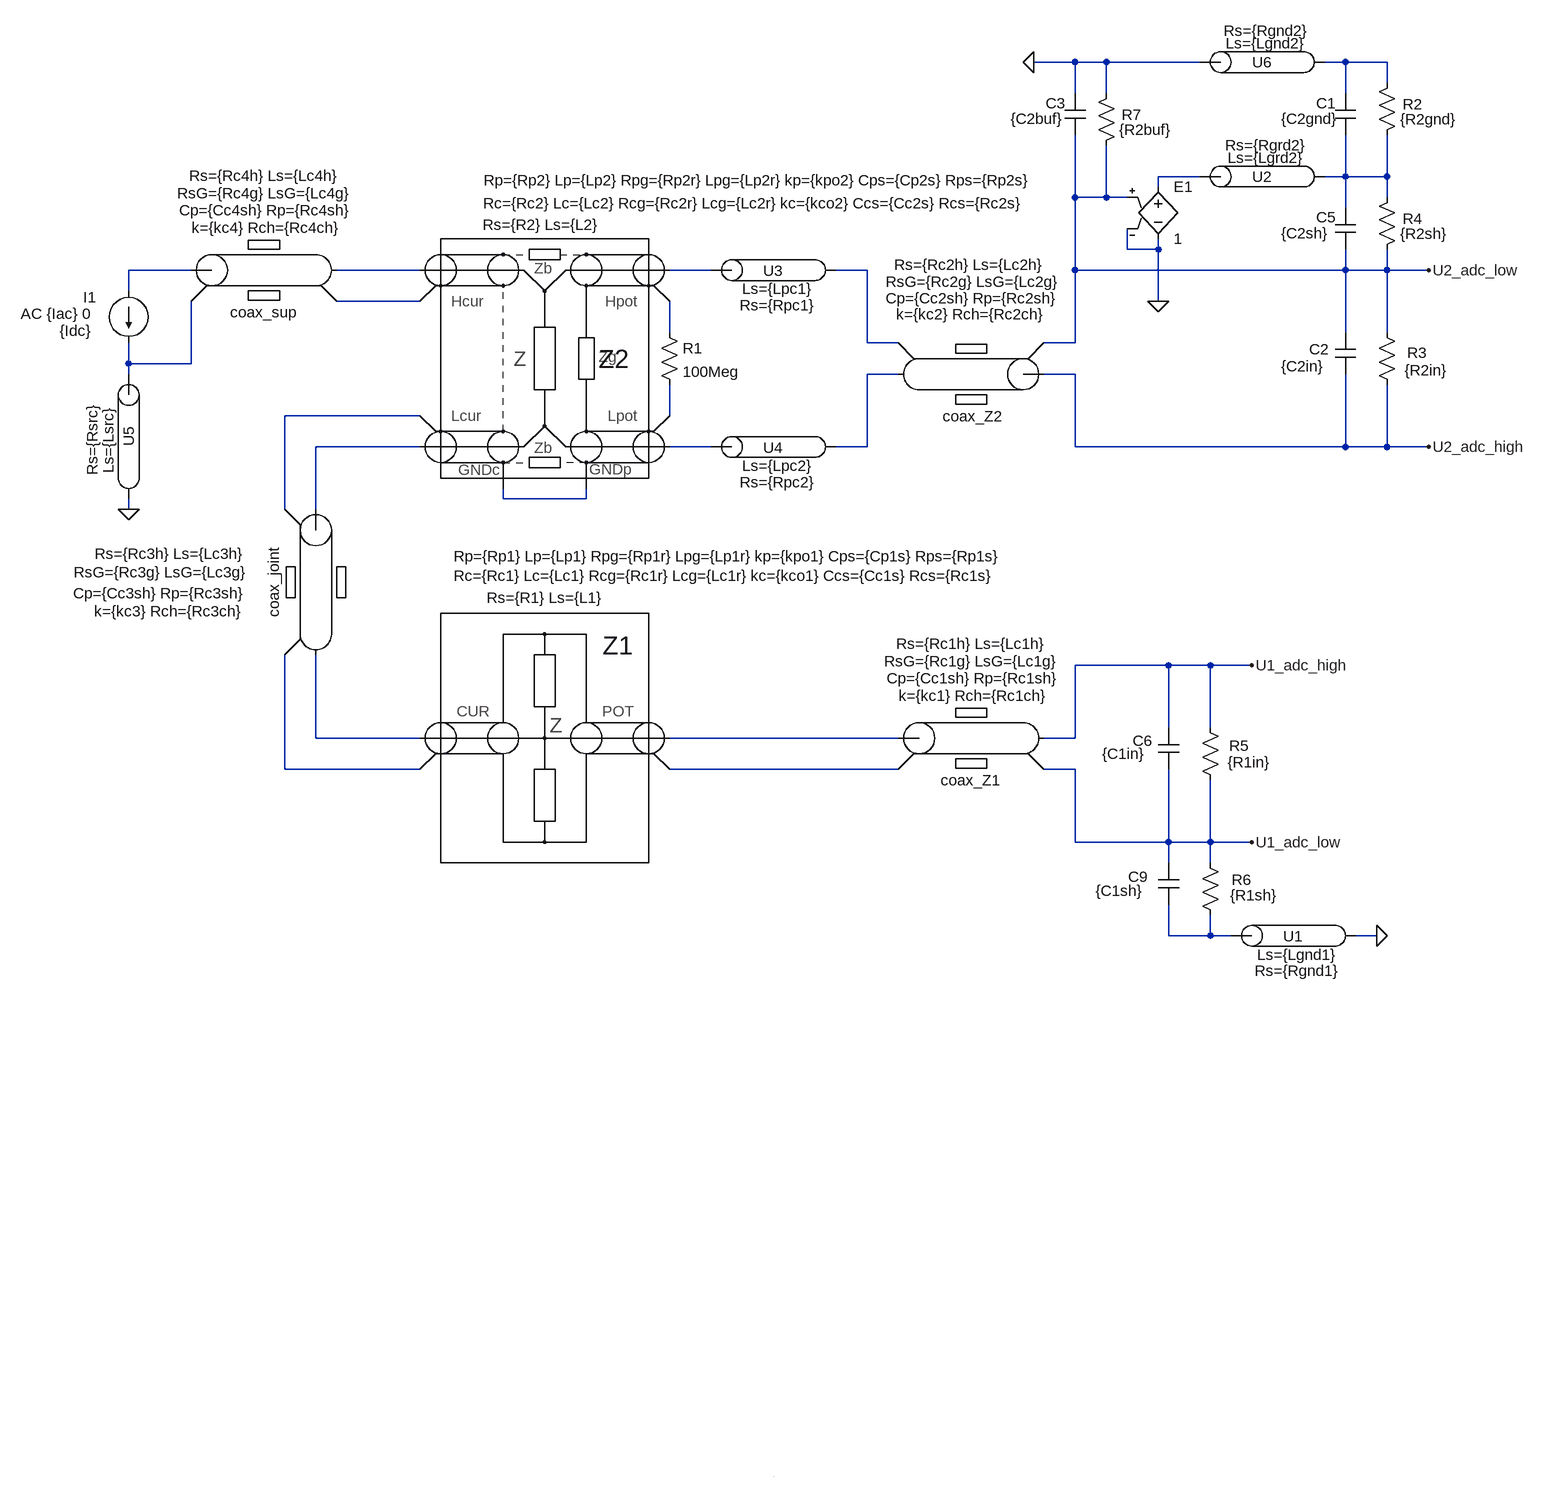
[diagram p0: schematic LiB_brg.asc]
LiB_brg.asc, the LTspice schematic file:
Version 4
SHEET 1 4400 2632
WIRE 464 -2176 400 -2176
WIRE 512 -2176 464 -2176
WIRE 656 -2176 512 -2176
WIRE 880 -2176 848 -2176
WIRE 944 -2176 880 -2176
WIRE 944 -2144 944 -2176
WIRE 464 -2128 464 -2176
WIRE 512 -2128 512 -2176
WIRE 880 -2128 880 -2176
WIRE 656 -2000 592 -2000
WIRE 880 -2000 880 -2064
WIRE 880 -2000 848 -2000
WIRE 944 -2000 944 -2064
WIRE 944 -2000 880 -2000
WIRE 592 -1984 592 -2000
WIRE 464 -1968 464 -2064
WIRE 512 -1968 512 -2048
WIRE 512 -1968 464 -1968
WIRE 544 -1968 512 -1968
WIRE 944 -1968 944 -2000
WIRE 880 -1952 880 -2000
WIRE 544 -1888 544 -1920
WIRE 592 -1888 592 -1904
WIRE 592 -1888 544 -1888
WIRE -896 -1856 -992 -1856
WIRE -544 -1856 -672 -1856
WIRE -96 -1856 -160 -1856
WIRE 144 -1856 96 -1856
WIRE 464 -1856 464 -1968
WIRE 880 -1856 880 -1888
WIRE 880 -1856 464 -1856
WIRE 944 -1856 944 -1888
WIRE 944 -1856 880 -1856
WIRE 1008 -1856 944 -1856
WIRE -992 -1824 -992 -1856
WIRE -544 -1808 -672 -1808
WIRE 592 -1808 592 -1888
WIRE -160 -1760 -160 -1808
WIRE 880 -1760 880 -1856
WIRE 944 -1760 944 -1856
WIRE 144 -1744 144 -1856
WIRE 192 -1744 144 -1744
WIRE 464 -1744 464 -1856
WIRE 464 -1744 416 -1744
WIRE -992 -1712 -992 -1744
WIRE -896 -1712 -896 -1808
WIRE -896 -1712 -992 -1712
WIRE -992 -1696 -992 -1712
WIRE 192 -1696 144 -1696
WIRE 464 -1696 416 -1696
WIRE -544 -1632 -752 -1632
WIRE -160 -1632 -160 -1680
WIRE -544 -1584 -704 -1584
WIRE -96 -1584 -160 -1584
WIRE 144 -1584 144 -1696
WIRE 144 -1584 96 -1584
WIRE 464 -1584 464 -1696
WIRE 880 -1584 880 -1696
WIRE 880 -1584 464 -1584
WIRE 944 -1584 944 -1680
WIRE 944 -1584 880 -1584
WIRE 1008 -1584 944 -1584
WIRE -416 -1504 -416 -1520
WIRE -288 -1504 -288 -1520
WIRE -288 -1504 -416 -1504
WIRE -992 -1488 -992 -1504
WIRE -752 -1488 -752 -1632
WIRE -704 -1488 -704 -1584
WIRE 608 -1248 464 -1248
WIRE 672 -1248 608 -1248
WIRE 736 -1248 672 -1248
WIRE 608 -1152 608 -1248
WIRE 672 -1152 672 -1248
WIRE -704 -1136 -704 -1264
WIRE -544 -1136 -704 -1136
WIRE 192 -1136 -160 -1136
WIRE 464 -1136 464 -1248
WIRE 464 -1136 416 -1136
WIRE -752 -1088 -752 -1264
WIRE -544 -1088 -752 -1088
WIRE 192 -1088 -160 -1088
WIRE 464 -1088 416 -1088
WIRE 464 -976 464 -1088
WIRE 608 -976 608 -1088
WIRE 608 -976 464 -976
WIRE 672 -976 672 -1072
WIRE 672 -976 608 -976
WIRE 736 -976 672 -976
WIRE 608 -944 608 -976
WIRE 672 -944 672 -976
WIRE 608 -832 608 -880
WIRE 672 -832 672 -864
WIRE 672 -832 608 -832
WIRE 704 -832 672 -832
WIRE 928 -832 896 -832
WIRE 0 0 0 0
FLAG 928 -832 0
FLAG -992 -1488 0
FLAG 736 -976 U1_adc_low
FLAG 736 -1248 U1_adc_high
FLAG 1008 -1584 U2_adc_high
FLAG 1008 -1856 U2_adc_low
FLAG 592 -1808 0
FLAG 400 -2176 0
SYMBOL std_coax -448 -1088 R0
WINDOW 0 209 -190 Center 4
WINDOW 3 386 -328 Center 2
WINDOW 123 376 -298 Center 2
WINDOW 39 97 -264 Center 2
SYMATTR InstName Z1
SYMATTR Value Rp={Rp1} Lp={Lp1} Rpg={Rp1r} Lpg={Lp1r} kp={kpo1} Cps={Cp1s} Rps={Rp1s}
SYMATTR Value2 Rc={Rc1} Lc={Lc1} Rcg={Rc1r} Lcg={Lc1r} kc={kco1} Ccs={Cc1s} Rcs={Rc1s}
SYMATTR SpiceLine Rs={R1} Ls={L1}
SYMBOL coax_cable -704 -1376 R90
WINDOW 0 0 65 Center 2
WINDOW 3 -44 224 VCenter 2
WINDOW 123 -15 238 VCenter 2
WINDOW 39 45 227 VCenter 2
WINDOW 40 17 240 VCenter 2
SYMATTR InstName coax_joint
SYMATTR Value Rs={Rc3h} Ls={Lc3h}
SYMATTR Value2 RsG={Rc3g} LsG={Lc3g}
SYMATTR SpiceLine k={kc3} Rch={Rc3ch}
SYMATTR SpiceLine2 Cp={Cc3sh} Rp={Rc3sh}
SYMBOL coax_cable -784 -1856 R0
WINDOW 0 0 65 Center 2
WINDOW 3 1 -145 Center 2
WINDOW 123 1 -118 Center 2
WINDOW 39 3 -65 Center 2
WINDOW 40 3 -92 Center 2
SYMATTR InstName coax_sup
SYMATTR Value Rs={Rc4h} Ls={Lc4h}
SYMATTR Value2 RsG={Rc4g} LsG={Lc4g}
SYMATTR SpiceLine k={kc4} Rch={Rc4ch}
SYMATTR SpiceLine2 Cp={Cc4sh} Rp={Rc4sh}
SYMBOL current -992 -1824 R0
WINDOW 0 -70 10 Left 2
WINDOW 3 -106 61 Left 2
WINDOW 123 -166 35 Left 2
SYMATTR InstName I1
SYMATTR Value {Idc}
SYMATTR Value2 AC {Iac} 0
SYMBOL coax_cable 304 -1696 R180
WINDOW 0 -3 -65 Center 2
WINDOW 3 2 168 Center 2
WINDOW 123 -3 142 Center 2
WINDOW 39 1 92 Center 2
WINDOW 40 -2 117 Center 2
SYMATTR InstName coax_Z2
SYMATTR Value Rs={Rc2h} Ls={Lc2h}
SYMATTR Value2 RsG={Rc2g} LsG={Lc2g}
SYMATTR SpiceLine k={kc2} Rch={Rc2ch}
SYMATTR SpiceLine2 Cp={Cc2sh} Rp={Rc2sh}
SYMBOL res -176 -1776 R0
SYMATTR InstName R1
SYMATTR Value 100Meg
SYMBOL ground_lug 0 -1856 R0
WINDOW 0 -16 1 Left 2
WINDOW 3 6 54 Center 2
SYMATTR InstName U3
SYMATTR Value Rs={Rpc1}
SYMATTR Value2 Ls={Lpc1}
SYMBOL ground_lug 0 -1584 R0
WINDOW 0 -16 1 Left 2
WINDOW 3 6 54 Center 2
SYMATTR InstName U4
SYMATTR Value Rs={Rpc2}
SYMATTR Value2 Ls={Lpc2}
SYMBOL coax_cable 304 -1136 R0
WINDOW 0 0 65 Center 2
WINDOW 3 1 -145 Center 2
WINDOW 123 1 -118 Center 2
WINDOW 39 3 -65 Center 2
WINDOW 40 3 -92 Center 2
SYMATTR InstName coax_Z1
SYMATTR Value Rs={Rc1h} Ls={Lc1h}
SYMATTR Value2 RsG={Rc1g} LsG={Lc1g}
SYMATTR SpiceLine k={kc1} Rch={Rc1ch}
SYMATTR SpiceLine2 Cp={Cc1sh} Rp={Rc1sh}
SYMBOL cap 864 -1760 R0
WINDOW 0 -40 26 Left 2
WINDOW 3 -83 52 Left 2
SYMATTR InstName C2
SYMATTR Value {C2in}
SYMBOL res 928 -1776 R0
WINDOW 0 47 47 Left 2
WINDOW 3 43 74 Left 2
SYMATTR InstName R3
SYMATTR Value {R2in}
SYMBOL cap 864 -1888 M180
WINDOW 0 -29 49 Left 2
WINDOW 3 -83 25 Left 2
SYMATTR InstName C5
SYMATTR Value {C2sh}
SYMBOL res 928 -1872 M180
WINDOW 0 40 63 Left 2
WINDOW 3 36 40 Left 2
SYMATTR InstName R4
SYMATTR Value {R2sh}
SYMBOL cap 592 -1152 R0
WINDOW 0 -39 20 Left 2
WINDOW 3 -86 40 Left 2
SYMATTR InstName C6
SYMATTR Value {C1in}
SYMBOL res 656 -1168 R0
WINDOW 0 45 44 Left 2
WINDOW 3 43 69 Left 2
SYMATTR InstName R5
SYMATTR Value {R1in}
SYMBOL cap 592 -944 R0
WINDOW 0 -46 21 Left 2
WINDOW 3 -96 43 Left 2
SYMATTR InstName C9
SYMATTR Value {C1sh}
SYMBOL res 656 -960 R0
WINDOW 0 49 42 Left 2
WINDOW 3 47 66 Left 2
SYMATTR InstName R6
SYMATTR Value {R1sh}
SYMBOL ground_lug 752 -2000 M180
SYMATTR InstName U2
SYMATTR Value Rs={Rgrd2}
SYMATTR Value2 Ls={Lgrd2}
SYMBOL ground_lug 800 -832 R0
WINDOW 0 -16 1 Left 2
WINDOW 3 6 54 Center 2
SYMATTR InstName U1
SYMATTR Value Rs={Rgnd1}
SYMATTR Value2 Ls={Lgnd1}
SYMBOL ground_lug -992 -1600 R90
WINDOW 3 5 56 Center 2
WINDOW 123 6 31 Center 2
SYMATTR Value Rs={Rsrc}
SYMATTR Value2 Ls={Lsrc}
SYMATTR InstName U5
SYMBOL std_4TP2 -256 -1808 M0
WINDOW 0 -11 89 Center 4
WINDOW 3 -240 -186 Center 2
WINDOW 123 -229 -151 Center 2
WINDOW 39 101 -118 Center 2
SYMATTR InstName Z2
SYMATTR Value Rp={Rp2} Lp={Lp2} Rpg={Rp2r} Lpg={Lp2r} kp={kpo2} Cps={Cp2s} Rps={Rp2s}
SYMATTR Value2 Rc={Rc2} Lc={Lc2} Rcg={Rc2r} Lcg={Lc2r} kc={kco2} Ccs={Cc2s} Rcs={Rc2s}
SYMATTR SpiceLine Rs={R2} Ls={L2}
SYMBOL e 592 -2000 R0
SYMATTR InstName E1
SYMATTR Value 1
SYMBOL res 928 -2048 M180
WINDOW 0 40 63 Left 2
WINDOW 3 36 40 Left 2
SYMATTR InstName R2
SYMATTR Value {R2gnd}
SYMBOL cap 864 -2064 M180
WINDOW 0 -29 49 Left 2
WINDOW 3 -83 25 Left 2
SYMATTR InstName C1
SYMATTR Value {C2gnd}
SYMBOL ground_lug 752 -2176 M180
SYMATTR InstName U6
SYMATTR Value Rs={Rgnd2}
SYMATTR Value2 Ls={Lgnd2}
SYMBOL cap 448 -2064 M180
WINDOW 0 -29 49 Left 2
WINDOW 3 -83 25 Left 2
SYMATTR InstName C3
SYMATTR Value {C2buf}
SYMBOL res 496 -2032 M180
WINDOW 0 40 63 Left 2
WINDOW 3 36 40 Left 2
SYMATTR InstName R7
SYMATTR Value {R2buf}

The netlist it stands for:
* LiB_brg.asc
XZ1 N017 N019 N018 N020 STDCOAX Rp={Rp1} Lp={Lp1} Rpg={Rp1r} Lpg={Lp1r} kp={kpo1} Cps={Cp1s} Rps={Rp1s} Rc={Rc1} Lc={Lc1} Rcg={Rc1r} Lcg={Lc1r} kc={kco1} Ccs={Cc1s} Rcs={Rc1s} Rs={R1} Ls={L1}  ; pins Ch Cl Ph Pl
Xcoax_joint N014 N017 N012 N019 COAXCAB Rs={Rc3h} Ls={Lc3h} RsG={Rc3g} LsG={Lc3g} k={kc3} Rch={Rc3ch} Cp={Cc3sh} Rp={Rc3sh}  ; pins LA LB RA RB
Xcoax_sup N004 N005 N010 N008 COAXCAB Rs={Rc4h} Ls={Lc4h} RsG={Rc4g} LsG={Lc4g} k={kc4} Rch={Rc4ch} Cp={Cc4sh} Rp={Rc4sh}  ; pins LA LB RA RB
I1 N004 N010 {Idc} AC {Iac} 0
Xcoax_Z2 U2_adc_high N011 U2_adc_low N007 COAXCAB Rs={Rc2h} Ls={Lc2h} RsG={Rc2g} LsG={Lc2g} k={kc2} Rch={Rc2ch} Cp={Cc2sh} Rp={Rc2sh}  ; pins LA LB RA RB
R1 N009 N013 100Meg
XU3 N006 N007 GNDLUG Rs={Rpc1} Ls={Lpc1}  ; pins LA LB
XU4 N015 N011 GNDLUG Rs={Rpc2} Ls={Lpc2}  ; pins LA LB
Xcoax_Z1 N018 U1_adc_high N020 U1_adc_low COAXCAB Rs={Rc1h} Ls={Lc1h} RsG={Rc1g} LsG={Lc1g} k={kc1} Rch={Rc1ch} Cp={Cc1sh} Rp={Rc1sh}  ; pins LA LB RA RB
C2 U2_adc_low U2_adc_high {C2in}
R3 U2_adc_low U2_adc_high {R2in}
C5 U2_adc_low N003 {C2sh}
R4 U2_adc_low N003 {R2sh}
C6 U1_adc_high U1_adc_low {C1in}
R5 U1_adc_high U1_adc_low {R1in}
C9 U1_adc_low N021 {C1sh}
R6 U1_adc_low N021 {R1sh}
XU2 N002 N003 GNDLUG Rs={Rgrd2} Ls={Lgrd2}  ; pins LA LB
XU1 N021 0 GNDLUG Rs={Rgnd1} Ls={Lgnd1}  ; pins LA LB
XU5 N010 0 GNDLUG Rs={Rsrc} Ls={Lsrc}  ; pins LA LB
XZ2 N006 N009 N015 N013 N005 N008 N014 N012 N016 N016 STD4TP3 Rp={Rp2} Lp={Lp2} Rpg={Rp2r} Lpg={Lp2r} kp={kpo2} Cps={Cp2s} Rps={Rp2s} Rc={Rc2} Lc={Lc2} Rcg={Rc2r} Lcg={Lc2r} kc={kco2} Ccs={Cc2s} Rcs={Rc2s} Rs={R2} Ls={L2}  ; pins Hp HpG Lp LpG Hc HcG Lc LcG Gpot Gcur
E1 N002 0 U2_adc_low 0 1
R2 N003 N001 {R2gnd}
C1 N003 N001 {C2gnd}
XU6 0 N001 GNDLUG Rs={Rgnd2} Ls={Lgnd2}  ; pins LA LB
C3 U2_adc_low 0 {C2buf}
R7 U2_adc_low 0 {R2buf}
.lib ZbrgLib.cir ZbrgLib
.backanno
.end